# Altium schematic sheet Transmitter_original.SchDoc
size A0; SheetNumber: 1; SheetTotal: 1
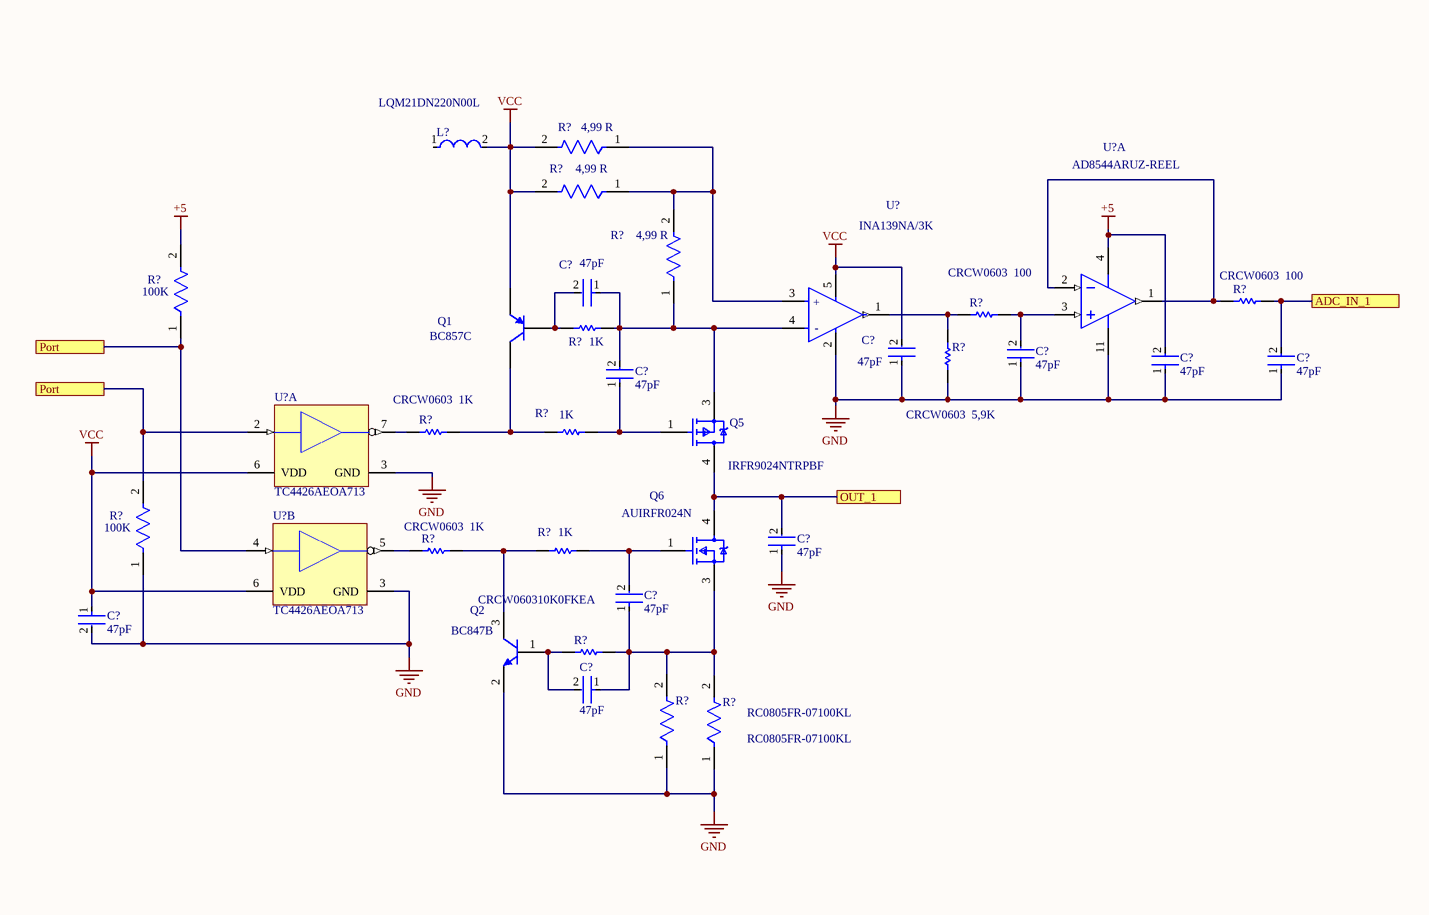
[diagram p0: Transmitter_original.SchDoc, left]
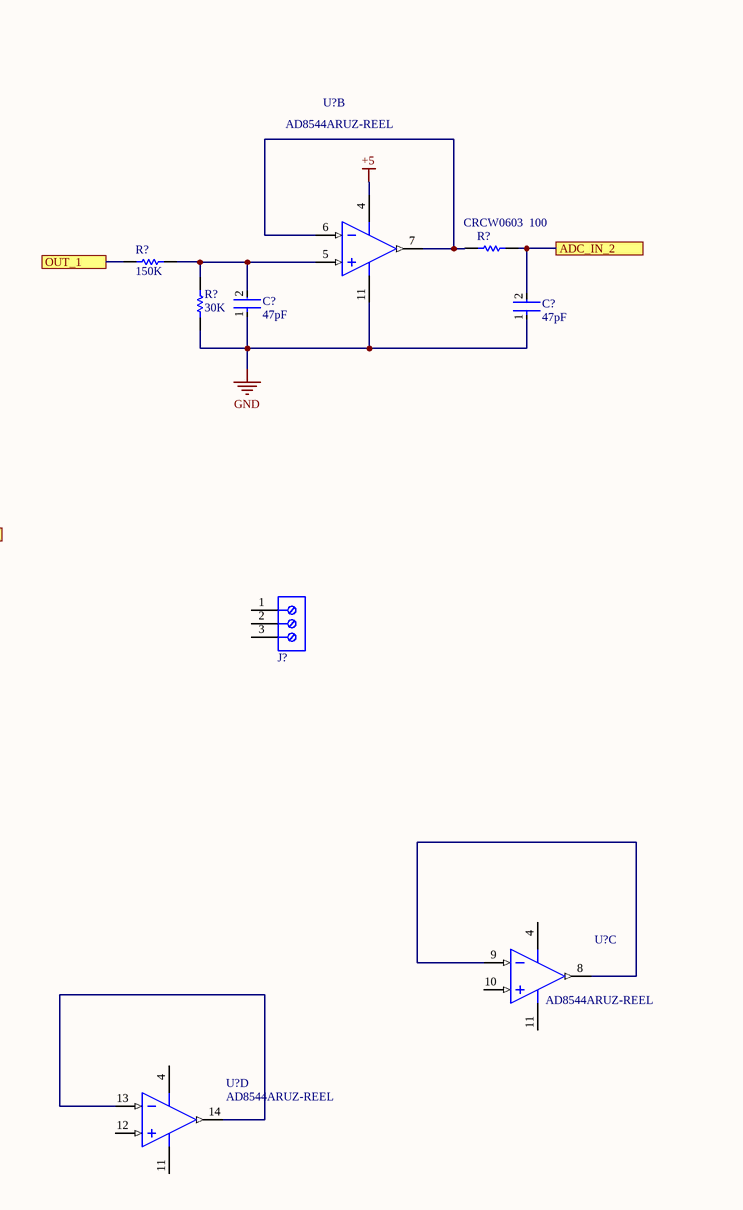
[diagram p1: Transmitter_original.SchDoc, middle]
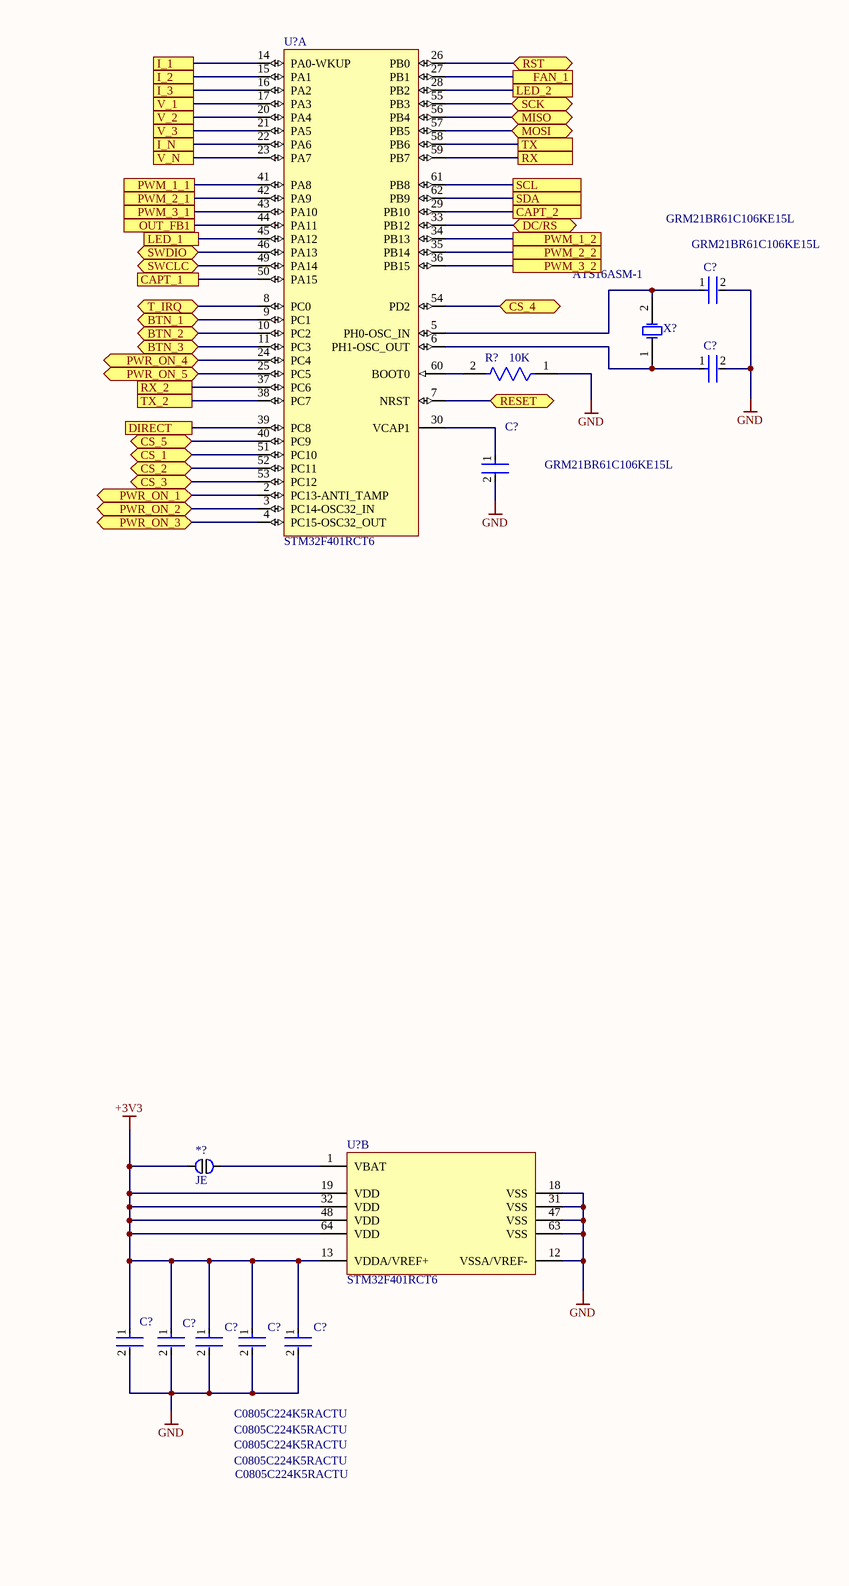
[diagram p2: Transmitter_original.SchDoc, right]

## Parts
(Parts that share a designator on the sheet are numbered #1, #2 ... from top to bottom, then left to right.)
*?  JE  [JE]
C?#1  GRM21BR61C106KE15L  [FP-GRM21B-0_1-IPC_C]
C?#2  GRM21BR61C106KE15L  [FP-GRM21B-0_1-IPC_C]
C?#3  GRM21BR61C106KE15L  [FP-GRM21B-0_1-IPC_C]
C?#4  47pF  [FP-C0603C-CF-MFG]
C?#5  47pF  [FP-C0603C-CF-MFG]
C?#6  47pF  [FP-C0603C-CF-MFG]
C?#7  47pF  [FP-C0603C-CF-MFG]
C?#8  47pF  [FP-C0603C-CF-MFG]
C?#9  47pF  [FP-C0603C-CF-MFG]
C?#10  47pF  [FP-C0603C-CF-MFG]
C?#11  47pF  [FP-C0603C-CF-MFG]
C?#12  C0805C224K5RACTU  [FP-C0805C-DN-IPC_A]
C?#13  C0805C224K5RACTU  [FP-C0805C-DN-IPC_A]
C?#14  C0805C224K5RACTU  [FP-C0805C-DN-IPC_A]
C?#15  C0805C224K5RACTU  [FP-C0805C-DN-IPC_A]
C?#16  C0805C224K5RACTU  [FP-C0805C-DN-IPC_A]
C?#17  47pF  [FP-C0603C-CF-MFG]
C?#18  47pF  [FP-C0603C-CF-MFG]
C?#19  47pF  [FP-C0603C-CF-MFG]
C?#20  47pF  [FP-C0603C-CF-MFG]
J?  691101710003  [691101710003]  (value not drawn)
L?  LQM21DN220N00L  [FP-LQM21DH_70-MFG]
Q1  BC857C  [INF-SOT23_N]
Q2  BC847B  [INF-SOT23_M]
Q5  IRFR9024NTRPBF  [FP-PG-TO252-3-MFG]
Q6  AUIRFR024N  [FP-TO-252AA-MFG]
R?#1  10K  [Vishay_CRCW0805-e3_IPC_A]
R?#2  CRCW0603  100  [RESC1609X50X30NL8T20]
R?#3  150K  [RESC1609X50X30NL8T20]
R?#4  30K  [RESC1609X50X30NL8T20]
R?#5  4,99 R  [FP-RC0805-0_6-IPC_A]
R?#6  4,99 R  [FP-RC0805-0_6-IPC_A]
R?#7  CRCW0603  100  [RESC1609X50X30NL8T20]
R?#8  4,99 R  [FP-RC0805-0_6-IPC_A]
R?#9  CRCW0603  100  [RESC1609X50X30NL8T20]
R?#10  1K  [RESC1609X50X30NL8T20]
R?#11  100K  [FP-RC0805-0_6-IPC_A]
R?#12  CRCW0603  5,9K  [RESC1609X50X30NL8T20]
R?#13  CRCW0603  1K  [RESC1609X50X30NL8T20]
R?#14  1K  [RESC1609X50X30NL8T20]
R?#15  CRCW0603  1K  [RESC1609X50X30NL8T20]
R?#16  1K  [RESC1609X50X30NL8T20]
R?#17  100K  [FP-RC0805-0_6-IPC_A]
R?#18  CRCW060310K0FKEA  [RESC1609X50X30NL8T20]
R?#19  RC0805FR-07100KL  [FP-RC0805-0_6-IPC_A]
R?#20  RC0805FR-07100KL  [FP-RC0805-0_6-IPC_A]
U?#1  STM32F401RCT6  [STM-LQFP64_M]  (part A of 2)
U?#2  AD8544ARUZ-REEL  [ADI-RU-14_L]  (part B of 4)
U?#3  AD8544ARUZ-REEL  [ADI-RU-14_N]  (part A of 4)
U?#4  STM32F401RCT6  [STM-LQFP64_M]  (part B of 2)
U?#5  INA139NA/3K  [FP-DBV0005A-IPC_A]
U?#6  TC4426AEOA713  [SOIC-OA8_N]  (part A of 3)
U?#7  TC4426AEOA713  [SOIC-OA8_N]  (part B of 3)
U?#8  AD8544ARUZ-REEL  [ADI-RU-14_N]  (part C of 4)
U?#9  AD8544ARUZ-REEL  [ADI-RU-14_N]  (part D of 4)
X?  ATS16ASM-1  [CTS-ATS-SM-XTAL-2]

## Ports
ADC_IN_1, ADC_IN_2, BTN_1 (bidir), BTN_2 (bidir), BTN_3 (bidir), CAPT_1, CAPT_2, CS_1 (bidir), CS_2 (bidir), CS_3 (bidir), CS_4 (bidir), CS_5 (bidir), DC/RS (bidir), DIRECT, FAN_1, I_1, I_2, I_3, I_N, LED_1, LED_2, MISO (bidir), MOSI (bidir), OUT_1, OUT_FB1, Port, PWM_1_1, PWM_1_2, PWM_2_1, PWM_2_2, PWM_3_1, PWM_3_2, PWR_ON_1 (bidir), PWR_ON_2 (bidir), PWR_ON_3 (bidir), PWR_ON_4 (bidir), PWR_ON_5 (bidir), RESET (bidir), RST (bidir), RX, RX_2, SCK (bidir), SCL, SDA, SWCLC (bidir), SWDIO (bidir), T_IRQ (bidir), TX, TX_2, V_1, V_2, V_3, V_N

## Nets
+3V3: *?.1 C?#12.1 C?#13.1 C?#14.1 C?#15.1 C?#16.1 U?#4.13(VDDA/VREF+) U?#4.19(VDD) U?#4.32(VDD) U?#4.48(VDD) U?#4.64(VDD)
+5: C?#9.2 R?#11.2 U?#2.4(+V) U?#3.4(+V)
GND: C?#1.2 C?#2.2 C?#3.2 C?#4.1 C?#5.1 C?#7.1 C?#8.1 C?#9.1 C?#10.1 C?#12.2 C?#13.2 C?#14.2 C?#15.2 C?#16.2 C?#17.1 C?#18.2 Q2.2(E) R?#1.1 R?#4.2 R?#12.1 R?#17.1 R?#19.1 R?#20.1 U?#2.11(-V) U?#3.11(-V) U?#4.12(VSSA/VREF-) U?#4.18(VSS) U?#4.31(VSS) U?#4.47(VSS) U?#4.63(VSS) U?#5.2(GND) U?#6.3(GND) U?#7.3(GND)
VCC: C?#7.2 C?#18.1 L?.2 Q1.2(E) R?#5.2 R?#6.2 U?#5.5(V+) U?#6.6(VDD) U?#7.6(VDD)
ADC_IN_1: C?#10.2 R?#7.1 ; port ADC_IN_1
ADC_IN_2: C?#5.2 R?#2.1 ; port ADC_IN_2
BTN_1: U?#1.9(PC1) ; port BTN_1
BTN_2: U?#1.10(PC2) ; port BTN_2
BTN_3: U?#1.11(PC3) ; port BTN_3
CAPT_1: U?#1.50(PA15) ; port CAPT_1
CAPT_2: U?#1.29(PB10) ; port CAPT_2
CS_1: U?#1.51(PC10) ; port CS_1
CS_2: U?#1.52(PC11) ; port CS_2
CS_3: U?#1.53(PC12) ; port CS_3
CS_4: U?#1.54(PD2) ; port CS_4
CS_5: U?#1.40(PC9) ; port CS_5
DC/RS: U?#1.33(PB12) ; port DC/RS
DIRECT: U?#1.39(PC8) ; port DIRECT
FAN_1: U?#1.27(PB1) ; port FAN_1
I_1: U?#1.14(PA0-WKUP) ; port I_1
I_2: U?#1.15(PA1) ; port I_2
I_3: U?#1.16(PA2) ; port I_3
I_N: U?#1.22(PA6) ; port I_N
LED_1: U?#1.45(PA12) ; port LED_1
LED_2: U?#1.28(PB2) ; port LED_2
MISO: U?#1.56(PB4) ; port MISO
MOSI: U?#1.57(PB5) ; port MOSI
OUT_1: C?#17.2 Q5.4(DRAIN) Q6.4(D) R?#3.2 ; port OUT_1
OUT_FB1: U?#1.44(PA11) ; port OUT_FB1
Port: R?#11.1 R?#17.2 U?#6.2(INA) U?#7.4(INB) ; port Port
PWM_1_1: U?#1.41(PA8) ; port PWM_1_1
PWM_1_2: U?#1.34(PB13) ; port PWM_1_2
PWM_2_1: U?#1.42(PA9) ; port PWM_2_1
PWM_2_2: U?#1.35(PB14) ; port PWM_2_2
PWM_3_1: U?#1.43(PA10) ; port PWM_3_1
PWM_3_2: U?#1.36(PB15) ; port PWM_3_2
PWR_ON_1: U?#1.2(PC13-ANTI_TAMP) ; port PWR_ON_1
PWR_ON_2: U?#1.3(PC14-OSC32_IN) ; port PWR_ON_2
PWR_ON_3: U?#1.4(PC15-OSC32_OUT) ; port PWR_ON_3
PWR_ON_4: U?#1.24(PC4) ; port PWR_ON_4
PWR_ON_5: U?#1.25(PC5) ; port PWR_ON_5
RESET: U?#1.7(NRST) ; port RESET
RST: U?#1.26(PB0) ; port RST
RX: U?#1.59(PB7) ; port RX
RX_2: U?#1.37(PC6) ; port RX_2
SCK: U?#1.55(PB3) ; port SCK
SCL: U?#1.61(PB8) ; port SCL
SDA: U?#1.62(PB9) ; port SDA
SWCLC: U?#1.49(PA14) ; port SWCLC
SWDIO: U?#1.46(PA13) ; port SWDIO
T_IRQ: U?#1.8(PC0) ; port T_IRQ
TX: U?#1.58(PB6) ; port TX
TX_2: U?#1.38(PC7) ; port TX_2
V_1: U?#1.17(PA3) ; port V_1
V_2: U?#1.20(PA4) ; port V_2
V_3: U?#1.21(PA5) ; port V_3
V_N: U?#1.23(PA7) ; port V_N
Net*?_2: *?.2 U?#4.1(VBAT)
NetC?#1_1: C?#1.1 U?#1.5(PH0-OSC_IN) X?.2(X2)
NetC?#2_1: C?#2.1 U?#1.6(PH1-OSC_OUT) X?.1(X1)
NetC?#3_1: C?#3.1 U?#1.30(VCAP1)
NetC?#4_2: C?#4.2 R?#3.1 R?#4.1 U?#2.5(+IN_B)
NetC?#6_1: C?#6.1 C?#11.2 Q5.3(SOURCE) R?#8.1 R?#10.2 U?#5.4(VIN-)
NetC?#6_2: C?#6.2 Q1.1(B) R?#10.1
NetC?#8_2: C?#8.2 R?#9.1 U?#3.3(+IN_A)
NetC?#11_1: C?#11.1 Q5.1(GATE) R?#14.2
NetC?#19_1: C?#19.1 C?#20.1 Q6.3(S) R?#18.2 R?#19.2 R?#20.2
NetC?#19_2: C?#19.2 Q6.1(G) R?#16.2
NetC?#20_2: C?#20.2 Q2.1(B) R?#18.1
NetQ1_3: Q1.3(C) R?#13.2 R?#14.1
NetQ2_3: Q2.3(C) R?#15.2 R?#16.1
NetR?#1_2: R?#1.2 U?#1.60(BOOT0)
NetR?#2_2: R?#2.2 U?#2.6(-IN_B) U?#2.7(OUT_B)
NetR?#5_1: R?#5.1 R?#6.1 R?#8.2 U?#5.3(VIN+)
NetR?#7_2: R?#7.2 U?#3.1(OUT_A) U?#3.2(-IN_A)
NetR?#9_2: R?#9.2 R?#12.2 U?#5.1(OUT)
NetR?#13_1: R?#13.1 U?#6.7(~{OUTA})
NetR?#15_1: R?#15.1 U?#7.5(~{OUTB})
NetU?#8_8: U?#8.8(OUT_C) U?#8.9(-IN_C)
NetU?#9_13: U?#9.13(-IN_D) U?#9.14(OUT_D)

Not connected (* = marked no-connect by the designer): J? 1 2 3; L? 1; U?#8 4(+V) 10(+IN_C) 11(-V); U?#9 4(+V) 11(-V) 12(+IN_D)

## Notes on the sheet
- (in symbol CMP-04910-000043-1) +; -

## Library data of the parts
C?#1-C?#3 = CMP-2007-03453-2: Chip Multilayer Ceramic Capacitors for General Purpose, 0805, 10uF, X5R, 15%, 10%, 16V; Radiation Hardening: No; Thickness: 0.053inch; Voltage Rating (DC): 16V; Lead Free: Lead Free; Package Quantity: 1; Width: 1.25mm; Case Code (Imperial): 0805; Depth: 1.25mm; Packaging: Tape and Reel; Dielectric: X5R; Max Operating Temperature: 85°C; Tolerance: 10%; Voltage Rating: 16V; Voltage: 16V; Capacitance: 10uF; Height: 1.25mm; Case Code (Metric): 2012; Material: Ceramic; Mount: Surface Mount; Case/Package: 0805; REACH SVHC: No SVHC; Length: 2mm; Min Operating Temperature: -55°C; Termination: SMD/SMT
C?#4-C?#11 C?#17-C?#20 = CMP-2006-03816-2: CAP CER 470PF 50V X7R 0603; Manufacturer Part Number: C0603C471K5RACTU; Manufacturer: KEMET; Tolerance: 0.1; Temperature Coefficient: 30ppm/°C; Material: Ceramic; Automotive Grade: Grade 1; Capacitance: 470 pF; Temperature Characteristic: X7R; Mouser Description: Ceramic Capacitor, 470Pf, 50V, X7R, 10%, 0603, Full Reel; Height: 0.87mm; Temperature: -55°C to +125°C; RoHS: TRUE; Lead Free: Yes; Category: Cap; ComponentLink2URL: https://api.kemet.com/component-edge/download/datasheet/C0603C100J5GACAUTO.pdf; Device Class L3: Ceramic Capacitors; Temperature Range High: +125°C; Package: C0603C-CF; Automotive: Yes; Device Class L2: Capacitors; Device Class L1: Passive Components; Value: 470 pF; Digikey Description: CAP CER 470PF 50V X7R 0603; Temperature Range Low: -55°C; ComponentLink2Description: Datasheet; Voltage Rating: 50 V; Octopart: https://octopart.com/c0603c471k5ractu-kemet-89311
C?#12-C?#16 = CMP-1036-04552-2: CAP CER 0.22UF 50V X7R 0805; Manufacturer: KEMET; Value: 0.22 μF; Temperature Coefficient: 30ppm/°C; Material: Ceramic; Tolerance: 0.1; ComponentLink2URL: https://content.kemet.com/datasheets/KEM_C1003_C0G_SMD.pdf; Temperature Characteristic: X7R; Device Class L3: Ceramic Capacitors; Lead Free: Yes; Temperature: -55°C to +125°C; RoHS: TRUE; Capacitance: 0.22 μF; Automotive: No; Octopart: https://octopart.com/c0805c224k5ractu-kemet-144670; Manufacturer Part Number: C0805C224K5RACTU; Temperature Range Low: -55°C; Height: 0.88mm; Device Class L1: Passive Components; Digikey Description: CAP CER 0.22UF 50V X7R 0805; ComponentLink2Description: Datasheet; Mouser Description: CAP CER 0.22UF 50V X7R 0805; Category: Cap; Ipc Land Pattern Name: CAPC200125X78; Temperature Range High: +125°C; Package: C0805C-DN; Device Class L2: Capacitors; Voltage Rating: 50 V
J? = 691101710003: WR-TBL Series 101 Horizontal Entry Modular, THT, pitch 5mm, 3p; Manufacturer: Wurth Elektronik; Modularity: Yes; Rated Current: 16A; Working Voltage: 250V; ComponentLink1Description: Website Link; ComponentLink1URL: https://www.we-online.com/redexpert/article/691101710003?ad; ComponentLink2Description: Datasheet Link; ComponentLink2URL: https://www.we-online.com/redexpert/spec/691101710003?ad; Manufacturer Part Number: 691101710003; Category: Terminal Blocks; Match Code: WR-TBL; Mount: Through Hole; Operating Temperature Max: 105°C; Operating Temperature Min: -40°C; Packaging: Box; Application: Pressure Clamp; Number of Pins: 3; Number of Rows: 1; Orientation: Horizontal; Pitch: 5mm
L? = CMP-06042-016874-1: Multilayer Type Inductor for Power Lines, 0805 (2012), 22μH, 30%, 0.65Ω, 13mA; Inductance: 22uH; Core Material: Ferrite; Test Frequency: 1MHz; Self Resonant Frequency: 16MHz; Shielding: Shielded; DC Resistance (DCR): 650mR; Max Operating Temperature: 85°C; Height - Seated (Max): 0.057inch; Width: 0.049inch; Case/Package: 0805; Tolerance: 30%; DC Current: 13mA; Package Quantity: 3000; Radiation Hardening: No; Case Code (Imperial): 0805; Series: LQM21D; Rated Current-Max: 13mA; Current Rating: 13mA; Depth: 1.45mm; Min Operating Temperature: -40°C; Height: 0.85mm; Max DC Current: 13mA; Packaging: Tape and Reel; Length: 2mm; Case Code (Metric): 2012; Mount: Surface Mount; Lead Free: Lead Free; Military Standard: Not; Termination: SMD/SMT
Q1 = CMP-1177-00039-1: PNP Silicon AF Transistor, 45 V VCEO, 100 mA IC, SOT23, Reel, Green; Manufacturer: Infineon; VCBO (max): 50Â V; fT (typ): 250Â MHz; ICBO (max): 15Â nA; IC (max): 100Â mA; Green: TRUE; IBM (max): 200Â mA; VEBO (max): 5Â V; VCEO (max): 45Â V; Ptot (max): 330Â mW; PackageDescription: 3-Pin Small Outline Transistor Package, 1.3 x 2.9 mm Body, 0.95 mm Pitch; ComponentLink2Description: Datasheet; PackageReference: SOT23; ComponentLink3Description: Package Specification; ComponentLink1URL: http://www.infineon.com/; ComponentLink1Description: Manufacturer URL; Mounting Technology: Surface Mount; PackageVersion: Apr-08; ComponentLink3URL: http://www.infineon.com/dgdl/SOT23-Package_Overview.pdf?folderId=db3a30431936bc4b0119532290053c66&fileId=db3a30431936bc4b0119533468123c85; ComponentLink2URL: http://www.infineon.com/dgdl/bc857series_bc858series_bc859series_bc860series.pdf?folderId=db3a304314dca389011541d30fa21656&fileId=db3a304314dca389011541da0e3a1661; Polarity: PNP; ICM (max): 200Â mA; PartNumber: BC857C; Packing: Reel
Q2 = CMP-1177-00042-1: NPN Silicon AF Transistor, 45 V VCEO, 100 mA IC, SOT23, Reel, Green; Manufacturer: Infineon; VEBO (max): 6Â V; ICBO (max): 15Â nA; VCBO (max): 50Â V; IBM (max): 200Â mA; Green: TRUE; Ptot (max): 330Â mW; fT (typ): 250Â MHz; IC (max): 100Â mA; VCEO (max): 45Â V; PackageDescription: 3-Pin Small Outline Transistor Package, 1.3 x 2.9 mm Body, 0.95 mm Pitch; ComponentLink3URL: http://www.infineon.com/dgdl/SOT23-Package_Overview.pdf?folderId=db3a30431936bc4b0119532290053c66&fileId=db3a30431936bc4b0119533468123c85; PackageVersion: Apr-08; Packing: Reel; ComponentLink3Description: Package Specification; ComponentLink2URL: http://www.infineon.com/dgdl/bc847series_bc848series_bc849series_bc850series.pdf?folderId=db3a304314dca389011541d30fa21656&fileId=db3a304314dca389011541d4630a1657; ComponentLink1URL: http://www.infineon.com/; ComponentLink2Description: Datasheet; Polarity: NPN; Mounting Technology: Surface Mount; PackageReference: SOT23; ICM (max): 200Â mA; ComponentLink1Description: Manufacturer URL; PartNumber: BC847B
Q5 = CMP-32901-000043-2: MOSFET P-CH 55V 11A DPAK; Power Dissipation: 38W; Rds On Max: 175mR; Drain to Source Breakdown Voltage: -55V; Turn-On Delay Time: 13ns; Threshold Voltage: -4V; Turn-Off Delay Time: 23ns; Rise Time: 55ns; Gate to Source Voltage (Vgs): 20V; Input Capacitance: 350pF; Max Operating Temperature: 150°C; Mount: Surface Mount; Contact Plating: Tin; Max Power Dissipation: 38W; Width: 0.245inch; RoHS Compliant: Yes; Lead Free: Contains Lead; REACH SVHC: No SVHC; Drain to Source Resistance: 175mR; Packaging: Tape and Reel; Halogen Free: Halogen Free; Continuous Drain Current (ID): 11A; Max Dual Supply Voltage: -55V; Number of Pins: 3; Height: 0.094inch; Min Operating Temperature: -55°C; Case/Package: TO-252-3; Drain to Source Voltage (Vdss): -55V
Q6 = CMP-00196-73408686-1: AUIRFR024N Automotive Q101 55V Single N-Channel HEXFET Power MOSFET in a D-Pak Package; Max Power Dissipation: 45W; Turn-Off Delay Time: 19ns; Rds On Max: 75mΩ; Fall Time: 27ns; Input Capacitance: 370pF; Turn-On Delay Time: 4.9ns; Number of Elements: 1; Threshold Voltage: 2V; Gate to Source Voltage (Vgs): 20V; Rise Time: 34ns; Continuous Drain Current (ID): 17A; NexarPartId: 73408686; Min Operating Temperature: -55°C; Mount: Surface Mount; Height: 2.39mm; Number of Pins: 3; Max Operating Temperature: 175°C; Radiation Hardening: No; Drain to Source Resistance: 75mΩ; Width: 6.22mm; Element Configuration: Single; Drain to Source Breakdown Voltage: 55V; REACH SVHC: No SVHC; Length: 6.73mm; Case/Package: DPAK; Contact Plating: Tin; Power Dissipation: 45W; RoHS: Compliant; Drain to Source Voltage (Vdss): 55V
R?#1 = CRCW08050000Z0EA
R?#2 R?#7 R?#9 R?#10 R?#13 R?#15 R?#18 = CMP-1666-00005-4: Chip Resistor, 10 KOhm, +/- 1%, 100 mW, -55 to 155 degC, 0603 (1608 Metric), RoHS, Tape and Reel; Manufacturer: Vishay Semiconductor; Voltage Rating: 75 V; Max Operating Temperature: 155 degC; PackageDescription: 2-Pin Surface Mount Device, Body 1.575 x 0.85 mm; ComponentLink1Description: Manufacturer URL; RoHSCompliant: true; PackageReference: 0603; REACH SVHC: Unknown; Length: 1.55 mm; DatasheetVersion: 06/2012; Packaging: Tape and Reel; Min Operating Temperature: -55 degC; Mounting Technology: Surface Mount; ComponentLink2URL: https://datasheet.ciiva.com/11809/0900766b80d98afc-11809037.pdf; Height: 0.45 mm; ComponentLink2Description: Datasheet; Package Quantity: 5000; ComponentLink1URL: http://www.vishay.com/
R?#3 R?#4 = CMP-1666-00005-4: Chip Resistor, 150 KOhm, +/- 1%, 100 mW, -55 to 155 degC, 0603 (1608 Metric), RoHS, Tape and Reel; Manufacturer: Vishay Semiconductor; Voltage Rating: 75 V; Max Operating Temperature: 155 degC; PackageDescription: 2-Pin Surface Mount Device, Body 1.575 x 0.85 mm; ComponentLink1Description: Manufacturer URL; RoHSCompliant: true; PackageReference: 0603; REACH SVHC: Unknown; Length: 1.55 mm; DatasheetVersion: 06/2012; Packaging: Tape and Reel; Min Operating Temperature: -55 degC; Mounting Technology: Surface Mount; ComponentLink2URL: https://datasheet.ciiva.com/11809/0900766b80d98afc-11809037.pdf; Height: 0.45 mm; ComponentLink2Description: Datasheet; Package Quantity: 5000; ComponentLink1URL: http://www.vishay.com/
R?#5 R?#6 R?#8 = CMP-2100-03668-5: RES 4,99 OHM 1% 1/8W 0805; Power Rating: 125mW; Temperature Coefficient: 100ppm/°C; Voltage Rating (DC): 150V; Resistance: 100kR; Package Quantity: 1; Case/Package: 0805; Lead Pitch: 0.4mm; Case Code (Imperial): 0805; Construction: Rectangular; Number of Terminations: 2; RoHS Compliant: Yes; Max Power Dissipation: 125mW; Tolerance: 1%; Max Operating Temperature: 155°C; Resistance Tolerance: 1%; Lead Free: Lead Free; Packaging: Tape and Reel; Resistor Type: Thick Film; Min Operating Temperature: -55°C; Case Code (Metric): 2012; Series: RC; Technology: THICK FILM; Voltage Rating: 150V; Termination: SMD/SMT; Width: 0.049inch; Number of Pins: 2; Features: Moisture Resistant; Military Standard: Not; Length: 0.079inch; Depth: 1.25mm; Size Code: 0805; Height: 0.024inch
R?#11 R?#17 R?#19 R?#20 = CMP-2100-03668-5: RES 100K OHM 1% 1/8W 0805; Power Rating: 125mW; Temperature Coefficient: 100ppm/°C; Voltage Rating (DC): 150V; Resistance: 100kR; Package Quantity: 1; Case/Package: 0805; Lead Pitch: 0.4mm; Case Code (Imperial): 0805; Construction: Rectangular; Number of Terminations: 2; RoHS Compliant: Yes; Max Power Dissipation: 125mW; Tolerance: 1%; Max Operating Temperature: 155°C; Resistance Tolerance: 1%; Lead Free: Lead Free; Packaging: Tape and Reel; Resistor Type: Thick Film; Min Operating Temperature: -55°C; Case Code (Metric): 2012; Series: RC; Technology: THICK FILM; Voltage Rating: 150V; Termination: SMD/SMT; Width: 0.049inch; Number of Pins: 2; Features: Moisture Resistant; Military Standard: Not; Length: 0.079inch; Depth: 1.25mm; Size Code: 0805; Height: 0.024inch
R?#12 = CMP-1666-00005-4: Chip Resistor, 5,9 KOhm, +/- 1%, 100 mW, -55 to 155 degC, 0603 (1608 Metric), RoHS, Tape and Reel; Manufacturer: Vishay Semiconductor; Voltage Rating: 75 V; Max Operating Temperature: 155 degC; PackageDescription: 2-Pin Surface Mount Device, Body 1.575 x 0.85 mm; ComponentLink1Description: Manufacturer URL; RoHSCompliant: true; PackageReference: 0603; REACH SVHC: Unknown; Length: 1.55 mm; DatasheetVersion: 06/2012; Packaging: Tape and Reel; Min Operating Temperature: -55 degC; Mounting Technology: Surface Mount; ComponentLink2URL: https://datasheet.ciiva.com/11809/0900766b80d98afc-11809037.pdf; Height: 0.45 mm; ComponentLink2Description: Datasheet; Package Quantity: 5000; ComponentLink1URL: http://www.vishay.com/
R?#14 R?#16 = CMP-1666-00005-4: Chip Resistor, 1 KOhm, +/- 1%, 100 mW, -55 to 155 degC, 0603 (1608 Metric), RoHS, Tape and Reel; Manufacturer: Vishay Semiconductor; Voltage Rating: 75 V; Max Operating Temperature: 155 degC; PackageDescription: 2-Pin Surface Mount Device, Body 1.575 x 0.85 mm; ComponentLink1Description: Manufacturer URL; RoHSCompliant: true; PackageReference: 0603; REACH SVHC: Unknown; Length: 1.55 mm; DatasheetVersion: 06/2012; Packaging: Tape and Reel; Min Operating Temperature: -55 degC; Mounting Technology: Surface Mount; ComponentLink2URL: https://datasheet.ciiva.com/11809/0900766b80d98afc-11809037.pdf; Height: 0.45 mm; ComponentLink2Description: Datasheet; Package Quantity: 5000; ComponentLink1URL: http://www.vishay.com/
U?#1 U?#4 = CMP-0243-00091-2: ARM Cortex-M4 32-bit MCU+FPU, 105 DMIPS, 256 kB Flash, 64 kB Internal RAM, 48 I/Os, 64-pin LQFP, -40 to 85 degC, Tray; Manufacturer: STMicroelectronics; Internal RAM Size (kB): 64; Supply Voltage(Vcc) max (V): 3.6; FLASH Size (Prog) (kB): 256; I/Os (High Current): 48; Operating Frequency(F) (Processor speed) (MHz): 84; Supply Voltage(Vcc) min (V): 1.8; DatasheetVersion: Rev. 1; ComponentLink1URL: http://www.st.com/web/en/home.html; ComponentLink1Description: Manufacturer URL; PackageDescription: 64-Pin Low Profile Quad Flat Package, 10 x 10 mm Body, 0.5 mm Pitch; Packing: Tray; ComponentLink3URL: http://www.st.com/st-web-ui/static/active/en/resource/technical/document/datasheet/DM00037051.pdf; PackageVersion: Rev. 4, 06/2013; ComponentLink2URL: http://www.st.com/st-web-ui/static/active/en/resource/technical/document/data_brief/DM00071938.pdf; PartNumber: STM32F401RCT6; PackageReference: LQFP64; Mounting Technology: Surface Mount; ComponentLink2Description: Datasheet; ComponentLink3Description: Package Specification; Core: ARM Cortex-M4
U?#2 U?#3 U?#8 U?#9 = CMP-0384-01917-1: Quad Channel RRIO Operational Amplifier, 1 MHz BW, 920 mV/us SR, Industrial, 14-pin SOP (RU-14), Reel; Manufacturer: Analog Devices; Generic Part Number: AD8544; Iq/Amp: 65uA; Automotive Qualified: Yes; Input Bias Current: 4pA; Amplifiers Per Package: 4; Small Signal Bandwidth: 1MHz; Input Offset Voltage: 1mV; V Span Min: 2.7V; V Span Max: 5.5V; Slew Rate: 920mV/us; ComponentLink3Description: Package Specification; ComponentLink2Description: Datasheet; ComponentLink2URL: http://www.analog.com/static/imported-files/data_sheets/AD8541_8542_8544.pdf; PartNumber: AD8544ARUZ-REEL; ComponentLink1Description: Manufacturer URL; DatasheetVersion: Rev. G; ComponentLink3URL: http://www.analog.com/static/imported-files/packages/36057385283879153717235186773RU14.pdf; ComponentLink1URL: http://www.analog.com/en/index.html; PackageReference: RU-14; PackageDescription: 14-Pin Thin Shrink Small Outline Package, Body 5 x 4.4 mm, Pitch 0.65 mm; Mounting Technology: Surface Mount; Code_JEDEC: MO-153AB-1
U?#5 = CMP-04910-000043-1: IC CURRENT MONITOR 0.5% SOT23-5; Common Mode Rejection Ratio: 100dB; Supply Current: 125uA; Max Supply Voltage: 40V; Number of Channels: 1; Input Offset Voltage (Vos): 1mV; Bandwidth: 440kHz; Input Bias Current: 10uA; Min Supply Voltage: 2.7V; Lead Free: Lead Free; Max Operating Temperature: 125°C; Min Operating Temperature: -40°C; Series: INA139; Number of Elements: 1; Radiation Hardening: No; Package Quantity: 3000; Nominal Supply Current: 125uA; Weight: 0.000617oz; Number of Pins: 5; Case/Package: SOT-23; Number of Amplifiers: 1; RoHS Compliant: Yes; Packaging: Tape and Reel; Accuracy: 0.5%; Mount: Surface Mount
U?#6 U?#7 = CMP-0137-00128-1: 1.5A Dual High-Speed Power MOSFET Driver, Inverting, Industrial Temperature, Tape and Reel; Code_IPC: SOIC127P600-8; PackageDescription: 8-Lead Plastic Small Outline (OA) - Narrow, 3.90mm Body [SOIC]; PackageVersion: revBB, Aug-2009; PackageReference: SOIC-OA8; DatasheetVersion: revD, Jan-2006
X? = CMP-0585-00002-2: ATS-SM Series Quartz Crystal, 16 MHz, -20 to 70 degC, 11.1 x 4.83 x 4.3mm SMD, RoHS, Tape and Reel; Manufacturer: CTS Corporation; Shunt Capacitance (C0): 7.0 pF Max; Frequency: 16 MHz; Oscillation Mode: Fundamental or 3rd Overtone; Crystal Cut: AT-Cut; ESR Maximum: 40 Ohms; Drive Level (Type): 100 uW; PackageDescription: 2-Pin SMD, Body 11.1 x 4.83 mm, Pitch 8.5 mm; PackageReference: ATS-SM-XTAL-2; ComponentLink1URL: http://www.ctscorp.com/; PartNumber: ATS16ASM-1; RoHS: TRUE; ComponentLink1Description: Manufacturer URL; Operating Temperature: -20 to 70 degC; DatasheetVersion: Rev. K; ComponentLink2Description: Datasheet; Packing: Tape and Reel; ComponentLink2URL: http://www.ctscorp.com/components/Datasheets/008-0309-0.pdf; Mounting Technology: Surface Mount; ComponentLink3URL: http://www.ctscorp.com/components/Datasheets/008-0309-0.pdf; ComponentLink3Description: Package Specification